# Altium schematic sheet nguyen lý.SchDoc
size A4
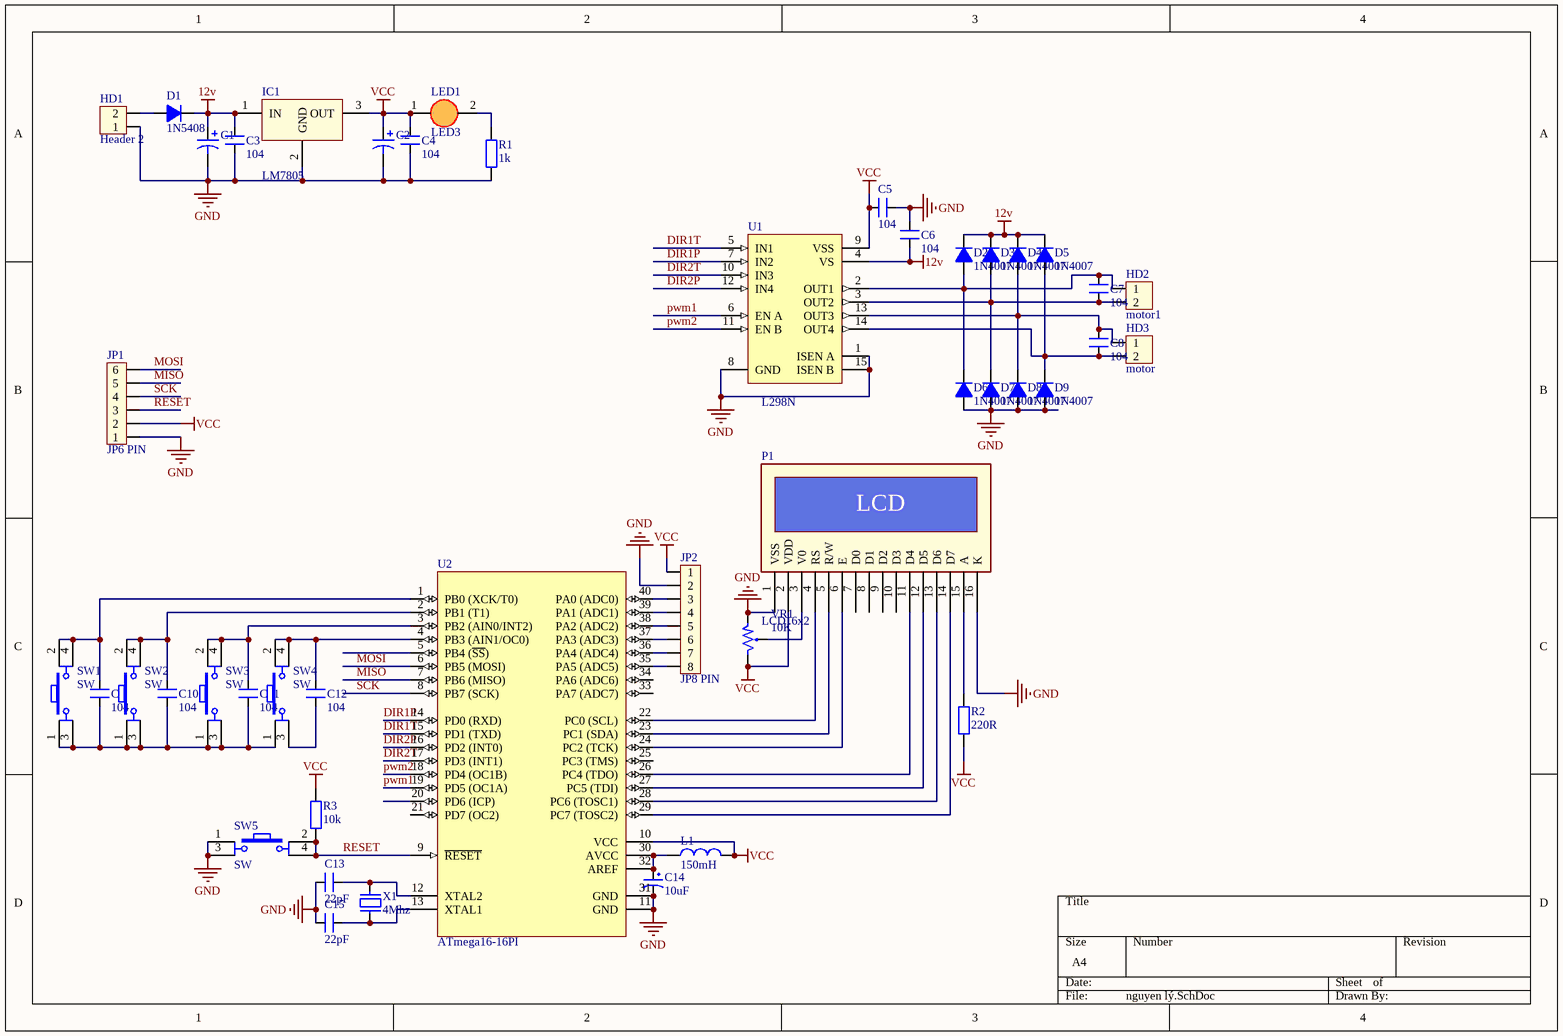
[diagram p0: nguyen lý.SchDoc]

## Parts
C1  Cap Pol 8mm  [C10mm]  (value not drawn)
C2  Cap Pol 8mm  [C10mm]  (value not drawn)
C3  104  [CN2]
C4  104  [CN2]
C5  104  [CN2]
C6  104  [CN2]
C7  104  [CN2]
C8  104  [CN2]
C9  104  [CN1.5]
C10  104  [CN1.5]
C11  104  [CN1.5]
C12  104  [CN1.5]
C13  22pF  [CN1]
C14  10uF  [CP1/2]
C15  22pF  [CN1]
D1  1N5408  [D5A]
D2  1N4007  [D1A]
D3  1N4007  [D1A]
D4  1N4007  [D1A]
D5  1N4007  [D1A]
D6  1N4007  [D1A]
D7  1N4007  [D1A]
D8  1N4007  [D1A]
D9  1N4007  [D1A]
HD1  Header 2  [HED2]
HD2  motor1  [HED2]
HD3  motor  [HED2]
IC1  LM7805  [TO-220]
JP1  JP6 PIN  [JP6]
JP2  JP8 PIN  [JP8]
L1  150mH  [L/0.4]
LED1  LED3  [LED3mm]
P1  LCD16x2  [LCD16X2N]
R1  1k  [R1/4W]
R2  220R  [R1/4W]
R3  10k  [R1/4W]
SW1  SW  [SW4]
SW2  SW  [SW4]
SW3  SW  [SW4]
SW4  SW  [SW4]
SW5  SW  [SW4]
U1  L298N  [DIP15SL2]
U2  ATmega16-16PI  [DIP40/W0.6]
VR1  10K  [VR1]
X1  4Mhz  [XT2]

## Nets
12v: C1.1 C3.2 C6.1 D1.2(K) D2.2(K) D3.2(K) D4.2(K) D5.2(K) IC1.1(IN) U1.4(VS)
GND: C1.2 C2.2 C3.1 C4.1 C5.2 C6.2 C13.1 C14.2 C15.1 D6.1(A) D7.1(A) D8.1(A) D9.1(A) HD1.1 IC1.2(GND) JP1.1 JP2.2 P1.1(VSS) P1.16(K) R1.1 SW5.1 SW5.3 U1.1(ISEN_A) U1.8(GND) U1.15(ISEN_B) U2.11(GND) U2.31(GND) VR1.1
VCC: C2.1 C4.2 C5.1 IC1.3(OUT) JP1.2 JP2.1 L1.2 LED1.1(A) P1.2(VDD) R2.1 R3.2 U1.9(VSS) U2.10(VCC) VR1.3
DIR1P: U1.7(IN2) U2.14(PD0_(RXD))
DIR1T: U1.5(IN1) U2.15(PD1_(TXD))
DIR2P: U1.12(IN4) U2.16(PD2_(INT0))
DIR2T: U1.10(IN3) U2.17(PD3_(INT1))
MISO: JP1.5 U2.7(PB6_(MISO))
MOSI: JP1.6 U2.6(PB5_(MOSI))
pwm1: U1.6(EN_A) U2.19(PD5_(OC1A))
pwm2: U1.11(EN_B) U2.18(PD4_(OC1B))
RESET: JP1.3 R3.1 SW5.2 SW5.4 U2.9(~{RESET})
SCK: JP1.4 U2.8(PB7_(SCK))
NetC7_1: C7.1 D3.1(A) D7.2(K) HD2.2 U1.3(OUT2)
NetC7_2: C7.2 D2.1(A) D6.2(K) HD2.1 U1.2(OUT1)
NetC8_1: C8.1 D5.1(A) D9.2(K) HD3.2 U1.14(OUT4)
NetC8_2: C8.2 D4.1(A) D8.2(K) HD3.1 U1.13(OUT3)
NetC9_1: C9.1 C10.1 C11.1 SW1.1 SW1.3 SW2.1 SW2.3 SW3.1 SW3.3 SW4.1
NetC9_2: C9.2 SW1.2 SW1.4 U2.1(PB0_(XCK/T0))
NetC10_2: C10.2 SW2.2 SW2.4 U2.2(PB1_(T1))
NetC11_2: C11.2 SW3.2 SW3.4 U2.3(PB2_(AIN0/INT2))
NetC12_1: C12.1 SW4.3
NetC12_2: C12.2 SW4.2 SW4.4 U2.4(PB3_(AIN1/OC0))
NetC13_2: C13.2 U2.12(XTAL2) X1.2
NetC14_1: C14.1 L1.1 U2.30(AVCC) U2.32(AREF)
NetC15_2: C15.2 U2.13(XTAL1) X1.1
NetD1_1: D1.1(A) HD1.2
NetJP2_3: JP2.3 U2.40(PA0_(ADC0))
NetJP2_4: JP2.4 U2.39(PA1_(ADC1))
NetJP2_5: JP2.5 U2.38(PA2_(ADC2))
NetJP2_6: JP2.6 U2.37(PA3_(ADC3))
NetJP2_7: JP2.7 U2.36(PA4_(ADC4))
NetJP2_8: JP2.8 U2.35(PA5_(ADC5))
NetLED1_2: LED1.2(K) R1.2
NetP1_3: P1.3(V0) VR1.2
NetP1_4: P1.4(RS) U2.22(PC0_(SCL))
NetP1_5: P1.5(R/W) U2.23(PC1_(SDA))
NetP1_6: P1.6(E) U2.24(PC2_(TCK))
NetP1_11: P1.11(D4) U2.26(PC4_(TDO))
NetP1_12: P1.12(D5) U2.27(PC5_(TDI))
NetP1_13: P1.13(D6) U2.28(PC6_(TOSC1))
NetP1_14: P1.14(D7) U2.29(PC7_(TOSC2))
NetP1_15: P1.15(A) R2.2

Not connected (* = marked no-connect by the designer): P1 7(D0) 8(D1) 9(D2) 10(D3); U2 5(PB4_(~{SS})) 20(PD6_(ICP)) 21(PD7_(OC2)) 25(PC3_(TMS)) 33(PA7_(ADC7)) 34(PA6_(ADC6))

## Notes on the sheet
- (in symbol LCD Text) LCD

## Library data of the parts
C1 C2 = Cap Pol 8mm: Polarized Capacitor (Axial); Published: 8-Jun-2000; LatestRevisionDate: 17-Jul-2002; LatestRevisionNote: Re-released for DXP Platform.; PackageReference: POLAR0.8; Publisher: Altium Limited
C3-C8 = CN2: Cap np 104 => 105pF; Value: 0.1uF; Description: Cap np Cremic Value  104pF => 105pF
C9-C12 = CN1.5: Cap np 682pF => 104pF; Value: 0.01uF; Description: Cap np Cremic  682pF => 104 pF
C13 C15 = CN1: Cap np  1pF - 472pF; Value: 100pF; Description: Cap np Cremic Value  1pF => 472 pF
C14 = CP1: Cap P  0,1uF < 22uF , 16 - 50V; Value: 10uF/50V; Description 1: 10 => 220uF/6,3V/10V - 10uF => 100uF/16V; Description 2: 0,1uF => 33uF/50V - 10uF => 22uF/63V; Description 3: 0,47uF => 10uF/100V
D1 = D5A: Diode 5A; Value: 1N5408
D2-D9 = D1A: Diode 1A; Value: 1N4007
HD1-HD3 = Hed2: Header 2 (Green); Value: Header 2
IC1 = LM78xx: On ap +, from + 5 to + 24VDC; Value: LM7805
JP1 = JP6: Value: JP7
JP2 = JP8: Value: JP7
L1 = L1: Inductor; Value: 150 mH
LED1 = LED 3mm
P1 = LCD Text
R1-R3 = R1/4W: Resistor 1/4W; Value: R1/4W - 1K
SW1-SW5 = SW4: Switch button 4 pin; Value: Button chip 4 pin
U1 = L298N: Dual Full Bridge Driver; Published: 8-Jun-2000; LatestRevisionDate: 14-May-2007; LatestRevisionNote: Mapped to vertical PCB.; DatasheetVersion: Jul-1999; PackageReference: Multiwatt15V; Publisher: Altium Limited; PackageDescription: TO, Thru-Hole, Vertical, Heatsink Mounted; 15 Bent Staggered Leads; Pitch 1.27 mm; ComponentLink1Description: Manufacturer Link; ComponentLink1URL: http://www.st.com/; ComponentLink2Description: Datasheet; ComponentLink2URL: http://www.st.com/stonline/products/literature/ds/1773/l298.pdf
U2 = ATmega16-16PI: 8-Bit AVR Microcontroller with 16K Bytes of In-System Programmable Flash Memory; Published: 17-Sep-2003; LatestRevisionDate: 04-Mar-2005; LatestRevisionNote: Stylized 3D Model Added.; DatasheetVersion: 2466E-AVR-10/02; PackageVersion: Dec-1999; PackageReference: 40P6; Publisher: Altium Limited; PackageDescription: DIP; 40 Leads; Row Spacing 15.24 mm; Pitch 2.54 mm; ComponentLink1Description: Manufacturer Link; ComponentLink1URL: http://www.atmel.com; ComponentLink2Description: Datasheet; ComponentLink2URL: http://www.atmel.com/dyn/resources/prod_documents/doc2466.pdf
VR1 = VR1: Var Resistor; Value: VR 10K
X1 = XT2: Crystal For all Crystal 2pin.; Value: 4Mhz